# EasyEDA schematic SCH_2021-09-05.json
TITLE: Sheet_1; REV: 1.0; Date: 2021-08-26; Sheet: 1/1; Drawn By: Andreas Böhm; Company: Your Company
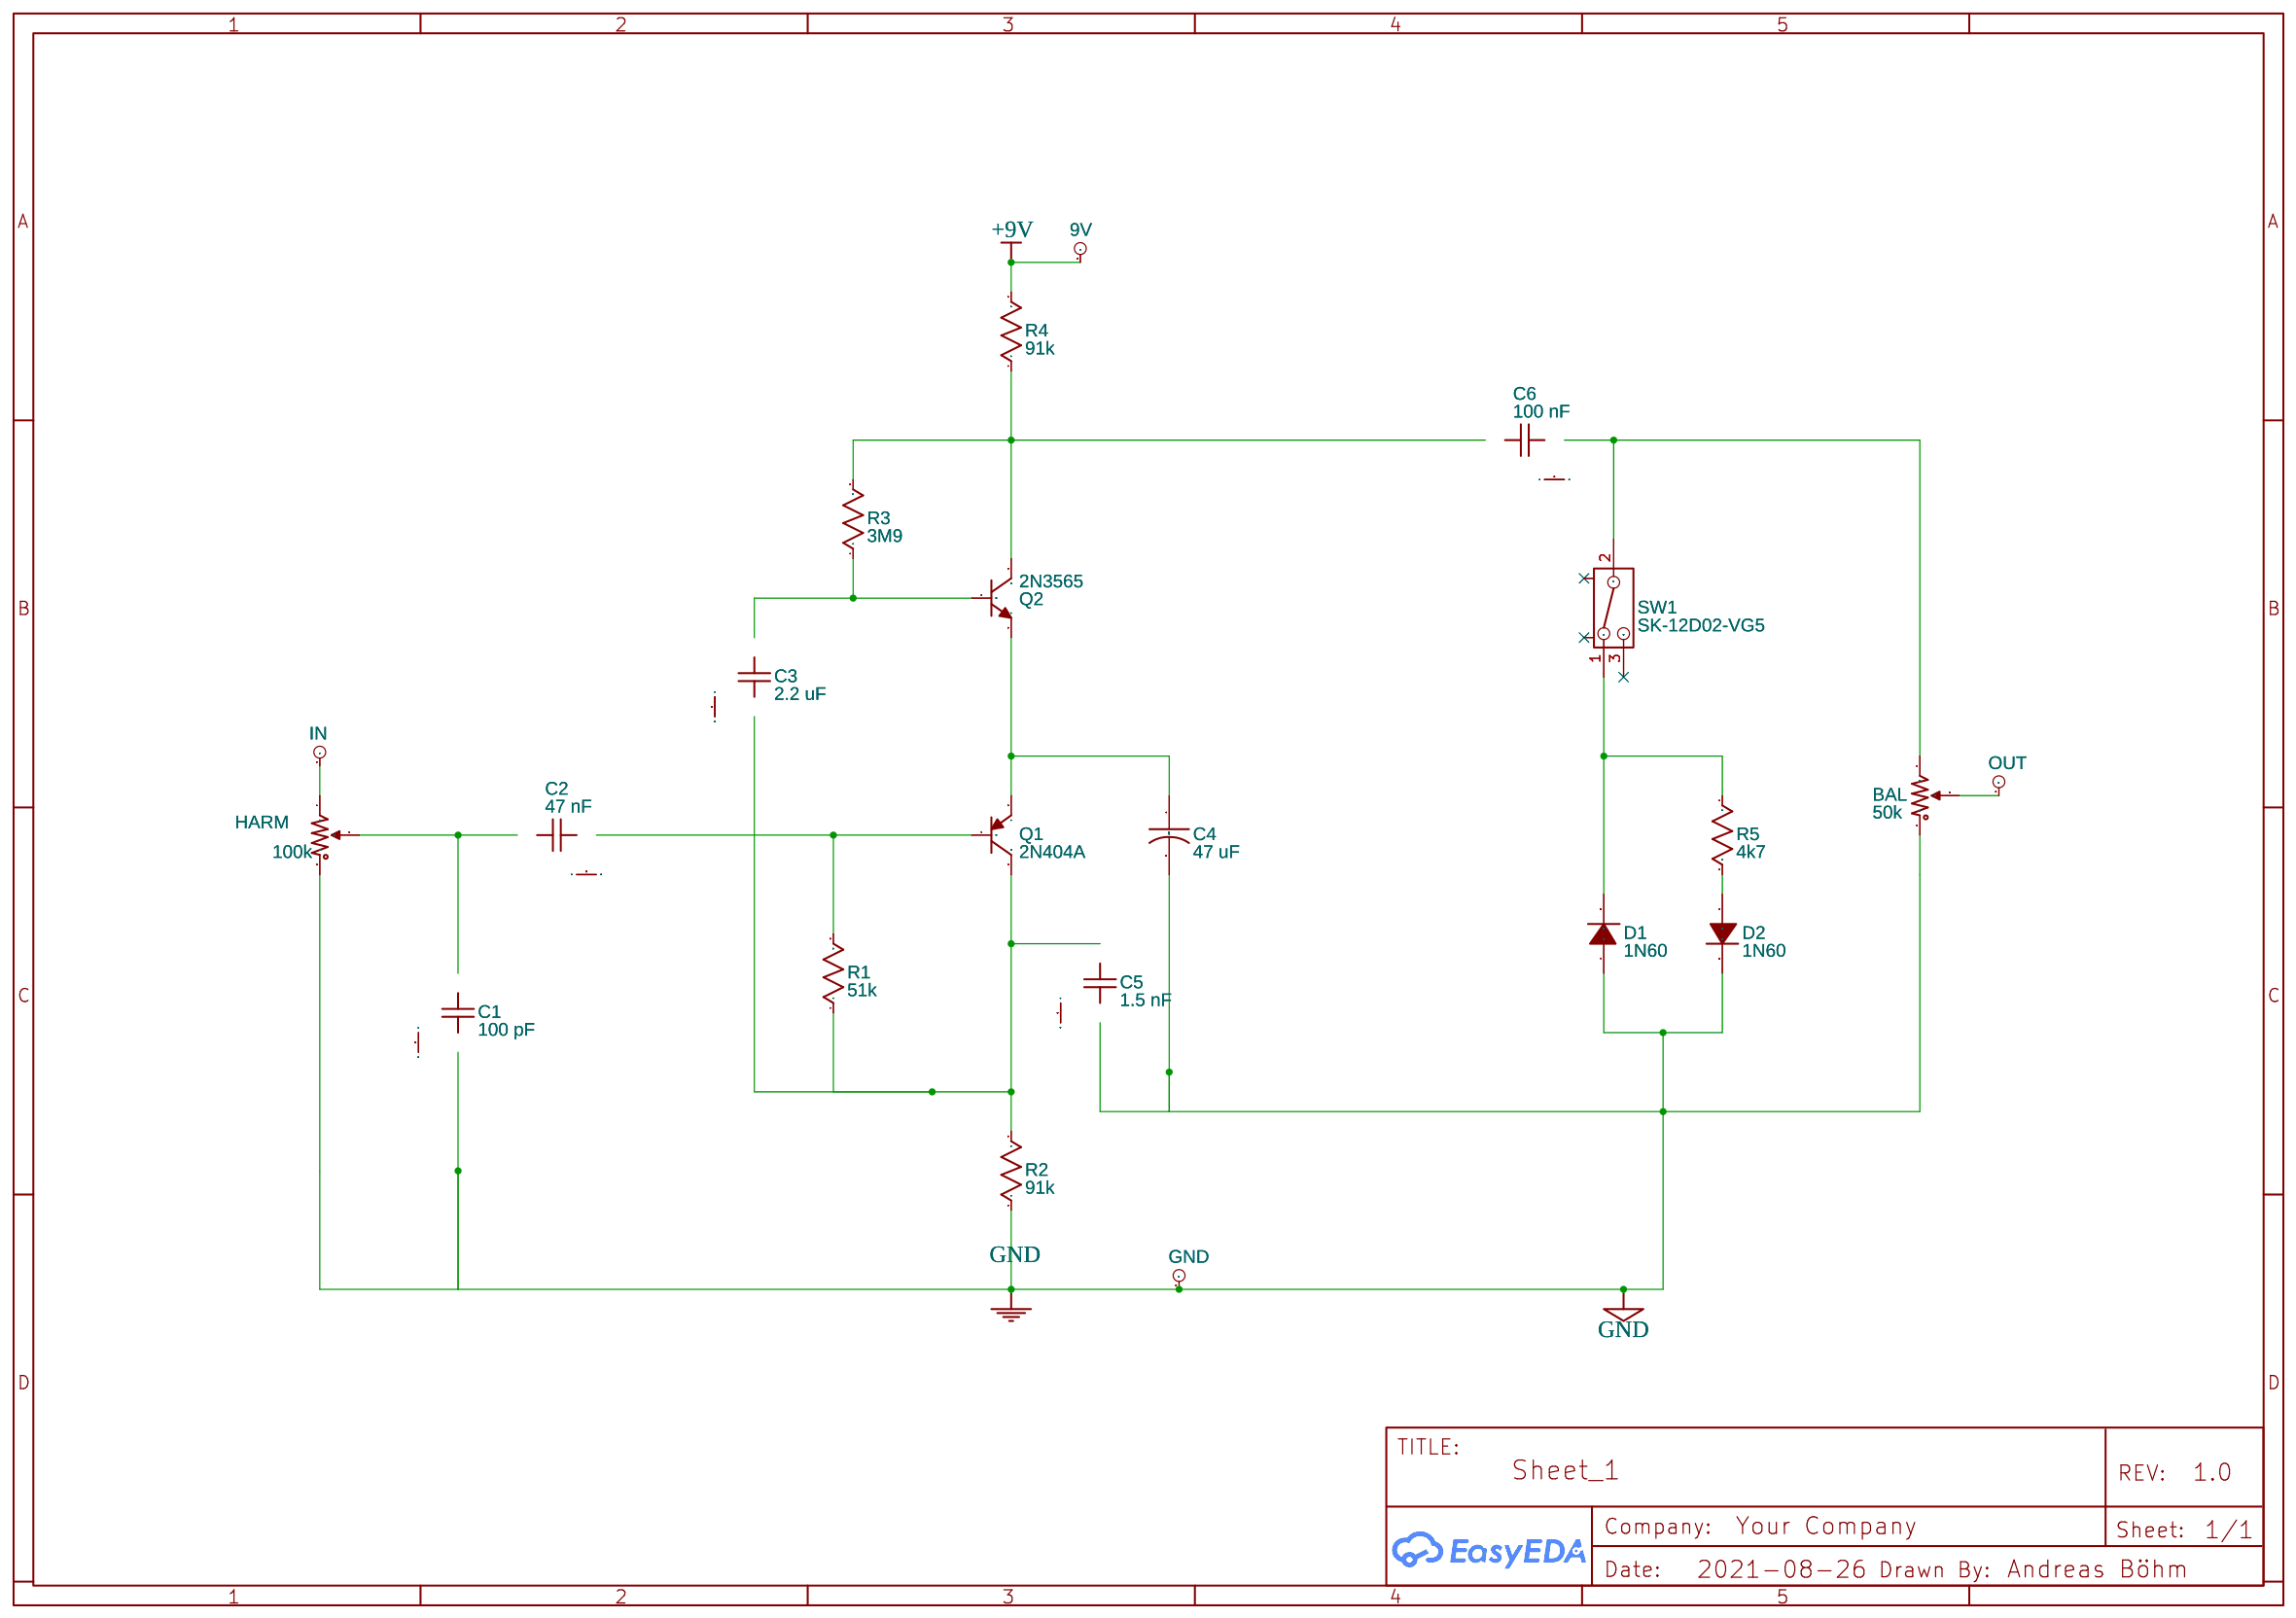
[diagram p0: schematic sheet]

## Parts
9V  9V  [PAD_TERMINAL-1.32MM_ROUND]
BAL  50k  [9MM ALPHA POT]
C1  100 pF  [MICA]
C2  47 nF  [CERAMIC-0.33NF]
C3  2.2 uF  [TANTALUM]
C4  47 uF  [TANTALUM]
C5  1.5 nF  [CERAMIC-0.33NF]
C6  100 nF  [CERAMIC-0.33NF]
D1  1N60  [DIODE-1N4148]
D2  1N60  [DIODE-1N4148]
GND  GND  [PAD_TERMINAL-1.32MM_ROUND]
HARM  100k  [9MM ALPHA POT]
IN  IN  [PAD_TERMINAL-1.32MM_ROUND]
OUT  OUT  [PAD_TERMINAL-1.32MM_ROUND]
Q1  2N404A  [TO5]
Q2  2N3565  [TO92]
R1  51k  [RESISTOR]
R2  91k  [RESISTOR]
R3  3M9  [RESISTOR]
R4  91k  [RESISTOR]
R5  4k7  [RESISTOR]
SW1  SK-12D02-VG5  [SPDT SWITCH]

## Library data of the parts
9V GND IN OUT = PAD_TERMINAL: Contributor: DangerousPrototype
BAL HARM = Potentiometer: K(%): 50; Manufacturer Part: ?
C1-C6 = Capacitor: Manufacturer Part: ?
D1 D2 = Diode: Manufacturer Part: ?
Q1 = PNP: Manufacturer Part: ?
Q2 = NPN: catid: 20; Manufacturer Part: ?
R1-R5 = Resistor: Manufacturer Part: ?
SW1 = SK-12D02-VG5: Supplier: LCSC; Supplier Part: C136722; Manufacturer: Rectangular Connectors - Contacts; Contributor: LCSC

## Nets
+9V: 9V.P R4.2
GND: BAL.3 C1.1 C4.2 C5.1 D1.A D2.C GND.P HARM.3 R2.1
Net-(BAL-1): BAL.1 C6.1 SW1.2
Net-(BAL-2): BAL.2 OUT.P
Net-(C1-2): C1.2 C2.2 HARM.2
Net-(C2-1): C2.1 Q1.1(B) R1.2
Net-(C3-1): C3.1(2) Q2.1(B) R3.1
Net-(C3-2): C3.2(1) C5.2 Q1.3(C) R1.1 R2.2
Net-(C4-1): C4.1 Q1.2(E) Q2.2(E)
Net-(C6-2): C6.2 Q2.3(C) R3.2 R4.1
Net-(D1-C): D1.C R5.1 SW1.1
Net-(D2-A): D2.A R5.2
Net-(HARM-1): HARM.1 IN.P

Not connected (* = marked no-connect by the designer): SW1 * 3*
